# Altium schematic sheet SDCard.SchDoc: Iris
size A3; Organization: Toradex AG; Address1: Altsagenstrasse 5; Address2: Horw; Address3: 6048; Address4: Switzerland; DocumentNumber: 7; Revision: V2.0; SheetNumber: 7; SheetTotal: 16
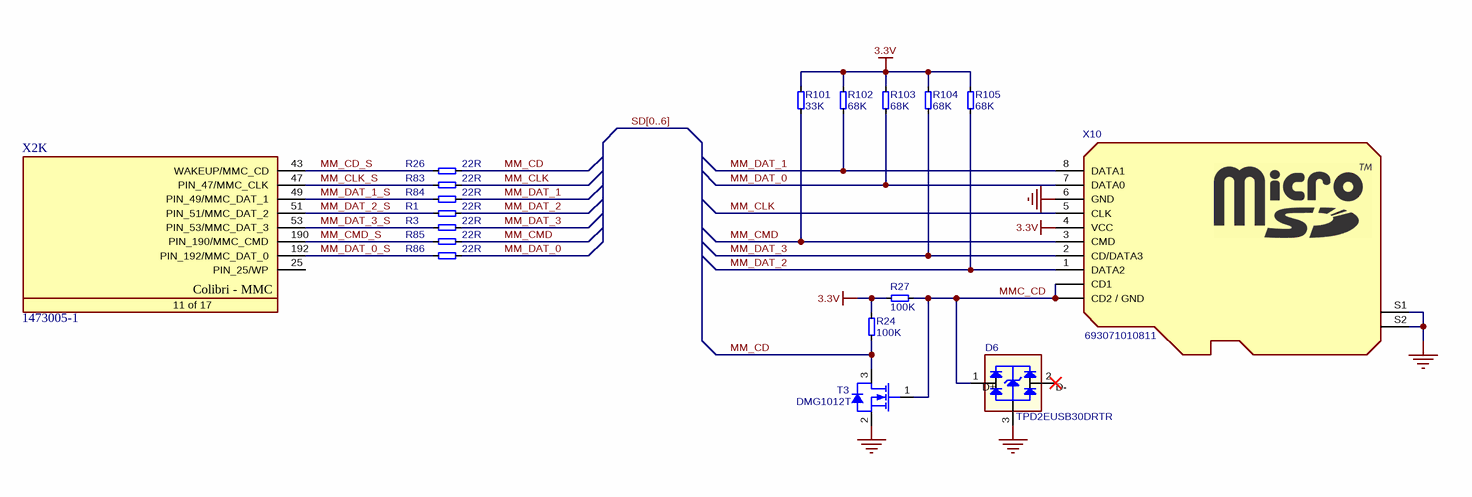
[diagram p0: SDCard.SchDoc]

## Parts
D6  TPD2EUSB30DRTR  [T_TI_TPD2EUSB30DRTR]
R1  22R  [RESC1005X40N]
R3  22R  [RESC1005X40N]
R24  100K  [T_RESC0603X30N]
R26  22R  [RESC1005X40N]
R27  100K  [T_RESC0603X30N]
R83  22R  [RESC1005X40N]
R84  22R  [RESC1005X40N]
R85  22R  [RESC1005X40N]
R86  22R  [RESC1005X40N]
R101  33K  [RESC1005X40N]
R102  68K  [RESC1005X40N]
R103  68K  [RESC1005X40N]
R104  68K  [RESC1005X40N]
R105  68K  [RESC1005X40N]
T3  Manufacturer Part No.: DMG1012T  [T_SOT50P160X80-3N]  (hidden comment: T-DiodeInc-DMG1012T)
X2  1473005-1  [T_Tyco_1473005-1]  (part K of 17)
X10  Manufacturer Part No.: 693071010811  [T_Wurth_693071010811]  (hidden comment: MicroSD Holder)

## Nets
3.3V: R24.2 R27.2 R101.2 R102.2 R103.2 R104.2 R105.2 X10.4(VCC)
GND: D6.3 T3.2(S) X10.6(GND) X10.S1(S) X10.S2(S)
MM_CD: R24.1 R26.2 T3.3(D)
MM_CD_S: R26.1 X2.43(WAKEUP/MMC_CD)
MM_CLK: R83.2 X10.5(CLK)
MM_CLK_S: R83.1 X2.47(PIN_47/MMC_CLK)
MM_CMD: R85.2 R101.1 X10.3(CMD)
MM_CMD_S: R85.1 X2.190(PIN_190/MMC_CMD)
MM_DAT_0: R86.2 R103.1 X10.7(DATA0)
MM_DAT_0_S: R86.1 X2.192(PIN_192/MMC_DAT_0)
MM_DAT_1: R84.2 R102.1 X10.8(DATA1)
MM_DAT_1_S: R84.1 X2.49(PIN_49/MMC_DAT_1)
MM_DAT_2: R1.2 R105.1 X10.1(DATA2)
MM_DAT_2_S: R1.1 X2.51(PIN_51/MMC_DAT_2)
MM_DAT_3: R3.2 R104.1 X10.2(CD/DATA3)
MM_DAT_3_S: R3.1 X2.53(PIN_53/MMC_DAT_3)
MMC_CD: D6.1(D+) R27.1 T3.1(G) X10.CD1 X10.CD2(CD2_/_GND)

Not connected (* = marked no-connect by the designer): D6 2(D-)*; X2 25(PIN_25/WP)

## Buses and harness runs
bus SD[0..6]

## Notes on the sheet
- Title
- Size:
- Date:
- A3
- Number:
- Time:
- Revision:
- Sheet
- of
- File:
- (in symbol CON-Tyco-1473005-1-200-0.6mm, part K) Colibri - MMC; 11 of 17

## Library data of the parts
D6 = D-TI-TPD2EUSB30DRTR: 2 Channel Protection for Super Speed USB3.0; Manufacturer Name: TI; Manufacturer Part No.: TPD2EUSB30DRTR
R1 R3 R26 R83-R86 = R-22R-63mW-5%-0402: Resistor 22 ohm 63mW 5% 0402; Rating: 63mW; Tolerance: 5%; Value: 22R
R24 R27 = R-100KR-63mW-5%-0603: Resistor 100 Kohm 63mW 5% 0603; Value: 100KR; Rating: 63mW; Tolerance: 5%
R101 = R-33KR-63mW-5%-0402: Resistor 33 Kohm 63mW 5% 0402; Value: 33KR; Rating: 63mW; Tolerance: 5%
R102-R105 = R-68KR-63mW-5%-0402: Resistor 68 Kohm 63mW 5% 0402; Value: 68KR; Rating: 63mW; Tolerance: 5%
T3 = T-DiodeInc-DMG1012T: N-Channel 20V (D-S)  MOSFET; Manufacturer Name: Diode Inc
X2 = CON-Tyco-1473005-1-200-0.6mm: SODIMM Connector; Manufacturer Name: Tyco; No. of ways: 200; Manufacturer Part No.: 1473005-1
X10 = CON-Wurth-693071010811: Micro SD Holder Push Push CD; Manufacturer Name: Wurth; No. of ways: 9